# EAGLE design Active Electrode (EAGLE 7.2.0)
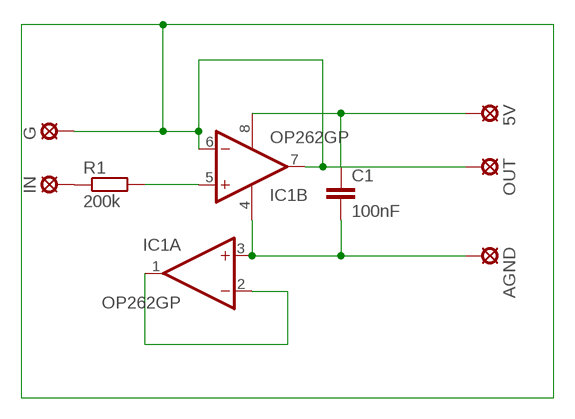
[diagram p0: schematic, sheet 1]

## Parts
5V  LSP10  [LSP10]
AGND  LSP10  [LSP10]
C1  100nF  C-EU025-024X044  [C025-024X044]
G  LSP10  [LSP10]
IC1  OP262GP  [DIL08]
IN  LSP10  [LSP10]
OUT  LSP10  [LSP10]
R1  200k  R-EU_0204/5  [0204/5]

## Nets
N$1: IC1.1(A:OUT) IC1.2(A:-IN)
N$2: AGND.MP C1.2 IC1.3(A:+IN) IC1.4(P:V-)
N$3: IC1.5(B:+IN) R1.2
N$4: IN.MP R1.1
N$6: 5V.MP C1.1 IC1.8(P:V+)
N$7: G.MP IC1.6(B:-IN) IC1.7(B:OUT) OUT.MP

## Library data of the parts
5V AGND G IN OUT = solpad:LSP10: SOLDER PAD drill 1.0 mm, distributor Buerklin, 12H555
C1 = rcl:C-EU: CAPACITOR, European symbol
IC1 = linear:OP262G: OP AMP
R1 = rcl:R-EU_: RESISTOR, European symbol

## Board
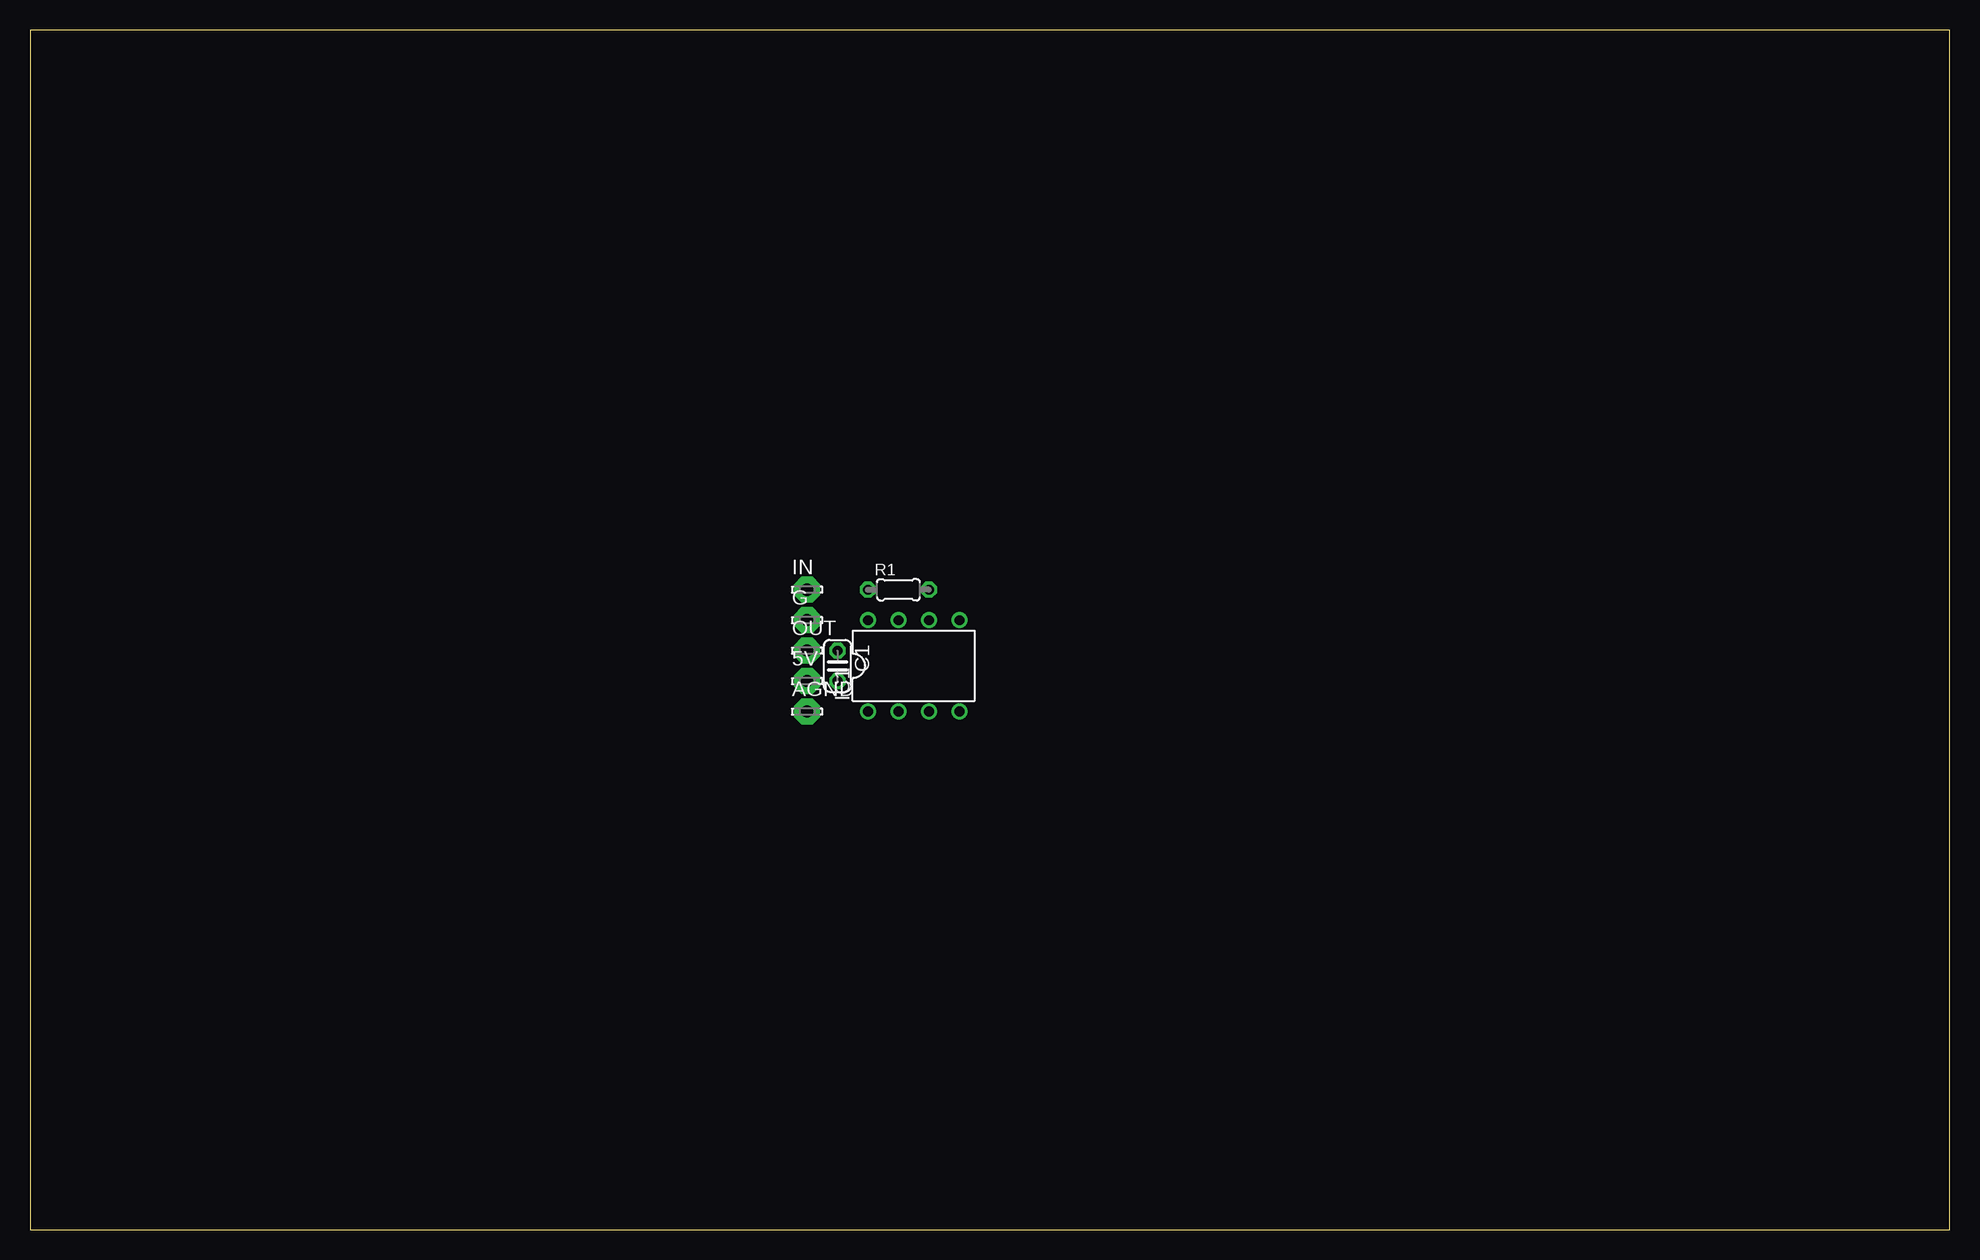
[diagram p1: board, top side]
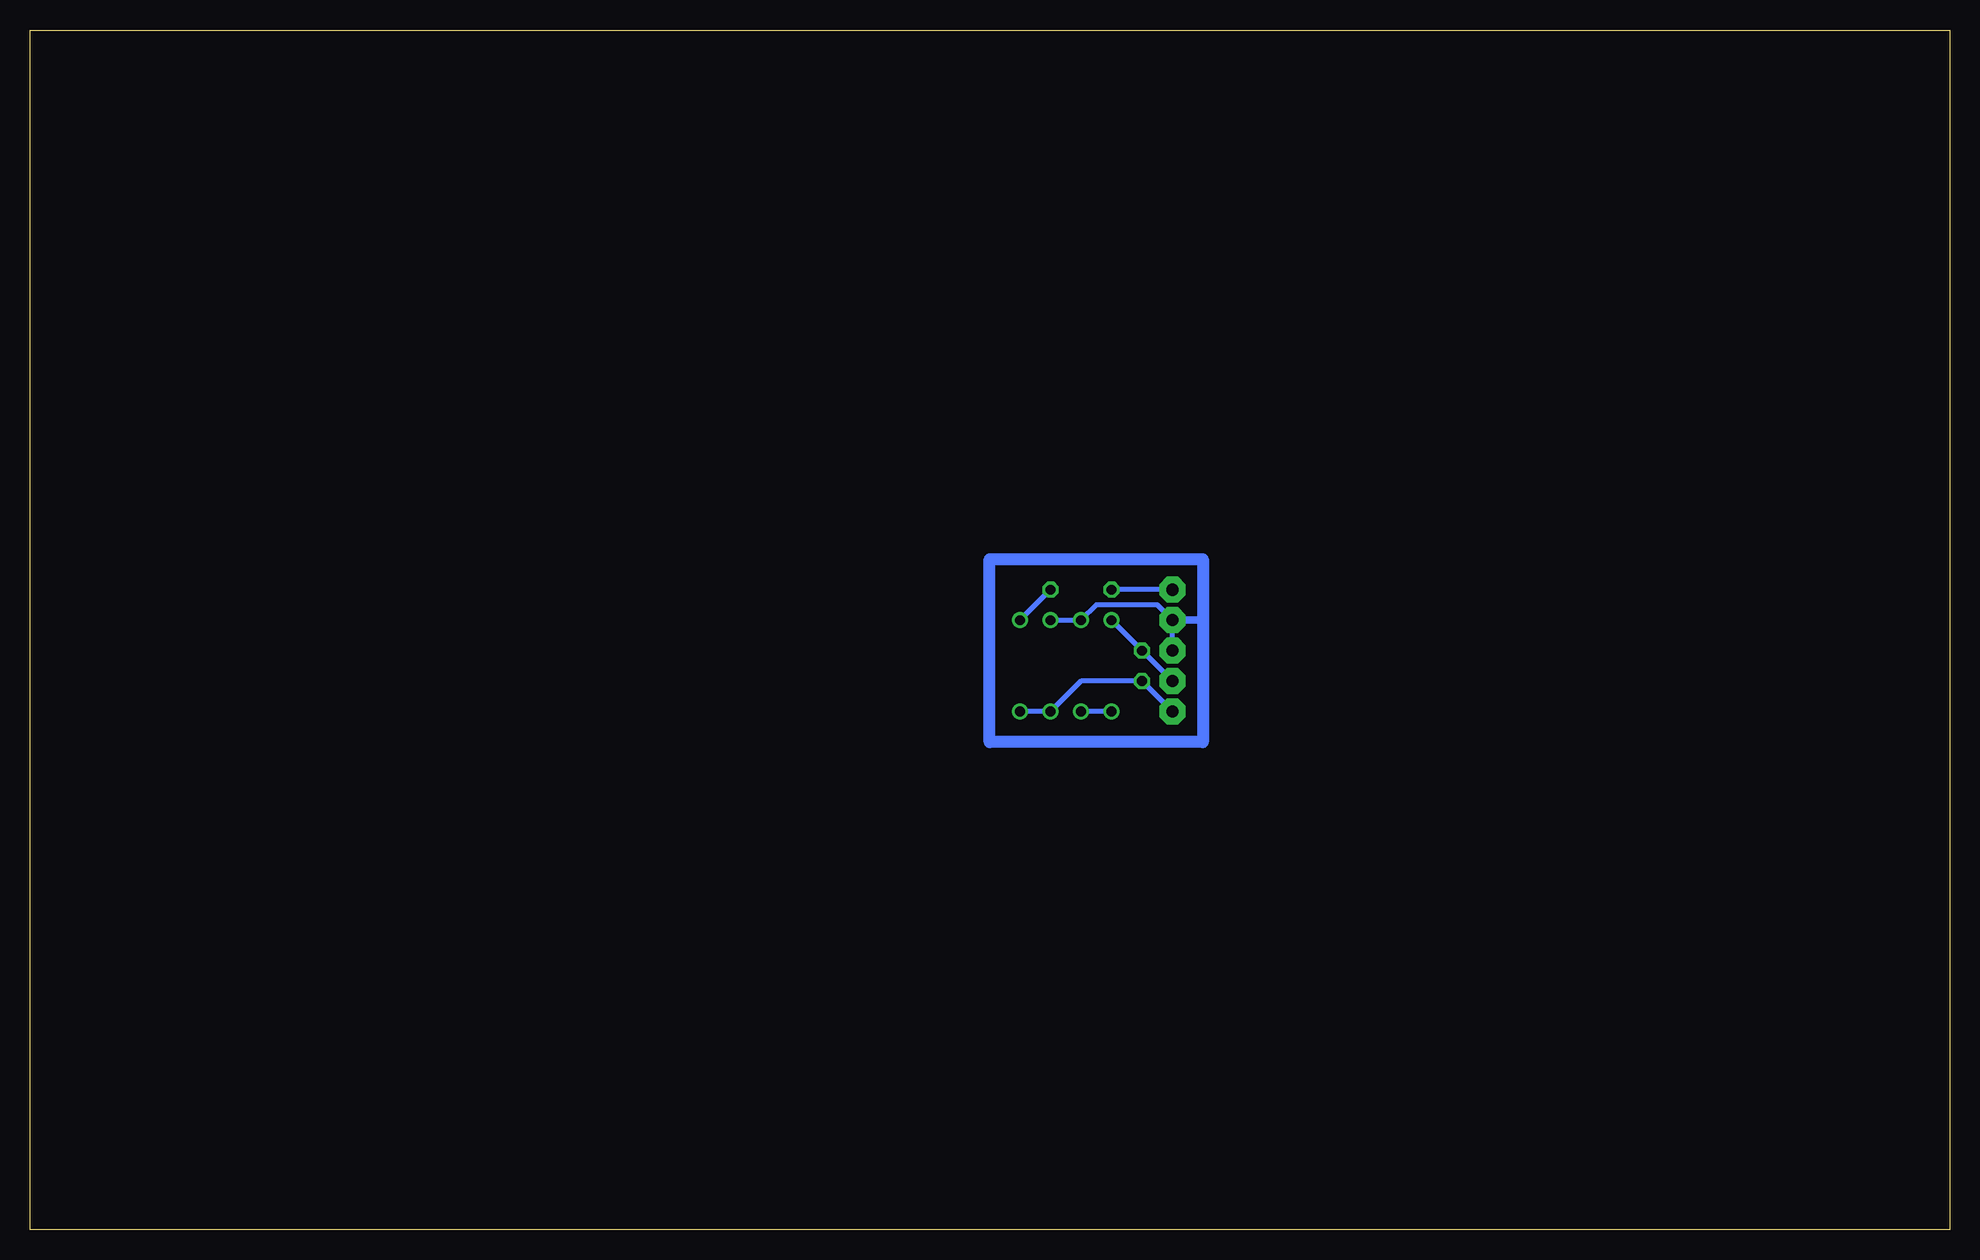
[diagram p2: board, bottom side, seen from below]

Size 160 x 100 mm. Coordinates in mm from the lower left corner, seen from the top.
Outline: 0,0 160,0 160,100 0,100 0,0
Copper layers (1*16): Top 0.035mm / dielectric 1.5mm / Bottom 0.035mm
Design rules "default": minimum track width 10mil, minimum drill 24mil, track to track 8mil, track to pad 8mil, pad to pad 8mil, via to via 8mil, smd to smd 8mil, copper to edge 40mil, drill to drill 8mil, minimum pad ring 10mil, minimum via ring 8mil, stop-mask expansion 4mil, vias tented up to drill 0mil, thermal gap 10mil

### Footprints (pad centres in the part's own frame; a part is rotated, then mirrored left to right if it is on the bottom)
LSP10 = drill 1.016 pad 2.159 octagon: MP 0,0
C025-024X044 = drill 0.813 octagon: 1 -1.27,0; 2 1.27,0
DIL08 = drill 0.813 pad 1.27: 1 -3.81,-3.81; 2 -1.27,-3.81; 3 1.27,-3.81; 4 3.81,-3.81; 5 3.81,3.81; 6 1.27,3.81; 7 -1.27,3.81; 8 -3.81,3.81
0204/5 = drill 0.813 octagon: 1 -2.54,0; 2 2.54,0

### Placement (x,y rotation side)
5V  64.77,45.72 0 top
AGND  64.77,43.18 0 top
C1  67.31,46.99 270 top
G  64.77,50.8 0 top
IC1  73.66,46.99 0 top
IN  64.77,53.34 0 top
OUT  64.77,48.26 0 top
R1  72.39,53.34 0 top

### Tracks (layer width: path | path; a pad name or v marks a point on that pad's centre or on a via)
N$1
  Bottom 0.406: IC1.1 IC1.2
N$2
  Bottom 0.406: AGND.MP C1.2 72.39,45.72 IC1.3 IC1.4
N$3
  Bottom 0.406: R1.2 IC1.5
N$4
  Bottom 0.406: IN.MP R1.1
N$6
  Bottom 0.406: 5V.MP C1.1 IC1.8
N$7
  Bottom 0.406: IC1.6 IC1.7 71.12,52.07 66.04,52.07 G.MP OUT.MP
  Bottom 0.61: 62.23,50.8 G.MP
  Bottom 1.016: 62.23,55.88 62.23,50.8 62.23,40.64 80.01,40.64 80.01,55.88 62.23,55.88